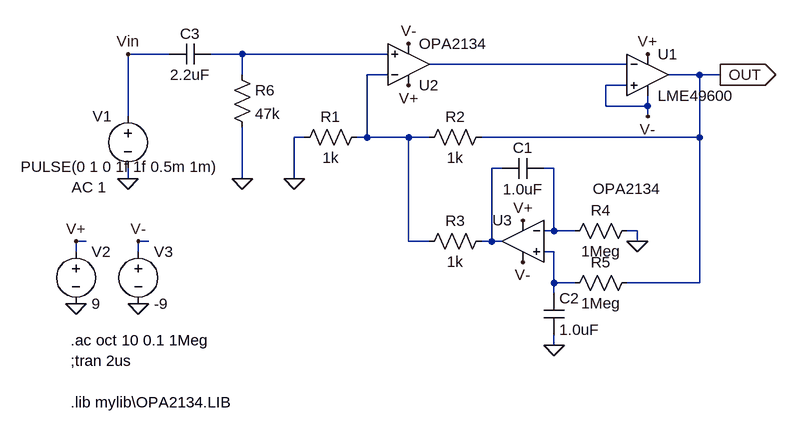
[diagram p0: schematic OPAMP_Servo_AC_Coupling.asc]
OPAMP_Servo_AC_Coupling.asc, the LTspice schematic file:
Version 4
SHEET 1 1064 680
WIRE -256 128 -320 128
WIRE -144 128 -192 128
WIRE 80 128 -144 128
WIRE 448 144 144 144
WIRE -144 160 -144 128
WIRE 80 160 48 160
WIRE 560 160 512 160
WIRE 592 160 560 160
WIRE 448 176 416 176
WIRE 416 208 416 176
WIRE 480 208 480 192
WIRE 480 208 416 208
WIRE -320 224 -320 128
WIRE 480 224 480 208
WIRE -48 256 -64 256
WIRE 48 256 48 160
WIRE 48 256 32 256
WIRE 112 256 48 256
WIRE 144 256 112 256
WIRE 560 256 560 160
WIRE 560 256 224 256
WIRE 256 304 240 304
WIRE 336 304 320 304
WIRE -320 320 -320 304
WIRE -144 320 -144 240
WIRE -64 320 -64 256
WIRE 336 400 336 304
WIRE 336 400 320 400
WIRE 368 400 336 400
WIRE 464 400 448 400
WIRE -384 416 -400 416
WIRE -288 416 -304 416
WIRE 112 416 112 256
WIRE 144 416 112 416
WIRE 240 416 240 304
WIRE 240 416 224 416
WIRE 256 416 240 416
WIRE 464 416 464 400
WIRE -400 432 -400 416
WIRE -304 432 -304 416
WIRE 336 432 320 432
WIRE 336 480 336 432
WIRE 368 480 336 480
WIRE 560 480 560 256
WIRE 560 480 448 480
WIRE 336 496 336 480
WIRE 336 576 336 560
FLAG -320 320 0
FLAG -400 512 0
FLAG -304 512 0
FLAG -400 416 V+
FLAG -304 416 V-
FLAG 480 128 V+
FLAG 480 224 V-
FLAG 592 160 OUT
IOPIN 592 160 Out
FLAG -64 320 0
FLAG 336 576 0
FLAG 464 416 0
FLAG 112 176 V+
FLAG 288 384 V+
FLAG 112 112 V-
FLAG 288 448 V-
FLAG -320 128 Vin
FLAG -144 320 0
SYMBOL Opamps\\LME49600 480 96 R0
SYMATTR InstName U1
SYMBOL voltage -320 208 R0
WINDOW 123 -87 125 Left 2
WINDOW 39 0 0 Left 2
WINDOW 0 -54 16 Left 2
WINDOW 3 -165 93 Left 2
SYMATTR Value2 AC 1
SYMATTR InstName V1
SYMATTR Value PULSE(0 1 0 1f 1f 0.5m 1m)
SYMBOL voltage -400 416 R0
WINDOW 123 0 0 Left 2
WINDOW 39 0 0 Left 2
SYMATTR InstName V2
SYMATTR Value 9
SYMBOL voltage -304 416 R0
WINDOW 123 0 0 Left 2
WINDOW 39 0 0 Left 2
SYMATTR InstName V3
SYMATTR Value -9
SYMBOL res 48 240 R90
WINDOW 0 0 56 VBottom 2
WINDOW 3 32 56 VTop 2
SYMATTR InstName R1
SYMATTR Value 1k
SYMBOL res 240 240 R90
WINDOW 0 0 56 VBottom 2
WINDOW 3 32 56 VTop 2
SYMATTR InstName R2
SYMATTR Value 1k
SYMBOL res 240 400 R90
WINDOW 0 0 56 VBottom 2
WINDOW 3 32 56 VTop 2
SYMATTR InstName R3
SYMATTR Value 1k
SYMBOL res 464 384 R90
WINDOW 0 0 56 VBottom 2
WINDOW 3 32 56 VTop 2
SYMATTR InstName R4
SYMATTR Value 1Meg
SYMBOL res 464 464 R90
WINDOW 0 0 56 VBottom 2
WINDOW 3 32 56 VTop 2
SYMATTR InstName R5
SYMATTR Value 1Meg
SYMBOL cap 320 288 R90
WINDOW 0 0 32 VBottom 2
WINDOW 3 32 32 VTop 2
SYMATTR InstName C1
SYMATTR Value 1.0uF
SYMBOL cap 320 496 R0
SYMATTR InstName C2
SYMATTR Value 1.0uF
SYMBOL Opamps\\opamp2 112 208 M180
SYMATTR InstName U2
SYMATTR Value OPA2134
SYMBOL Opamps\\opamp2 288 352 M0
WINDOW 3 -212 -17 Left 2
SYMATTR Value OPA2134
SYMATTR InstName U3
SYMBOL cap -192 112 R90
WINDOW 0 0 32 VBottom 2
WINDOW 3 32 32 VTop 2
SYMATTR InstName C3
SYMATTR Value 2.2uF
SYMBOL res -160 144 R0
SYMATTR InstName R6
SYMATTR Value 47k
TEXT -408 568 Left 2 !.ac oct 10 0.1 1Meg
TEXT -408 600 Left 2 !;tran 2us
TEXT -408 664 Left 2 !.lib mylib\\OPA2134.LIB

The netlist it stands for:
* OPAMP_Servo_AC_Coupling.asc
XU1 V- N002 V+ V- OUT LME49600  ; pins In+ In- V+ V- OUT
V1 Vin 0 PULSE(0 1 0 1f 1f 0.5m 1m) AC 1
V2 V+ 0 9
V3 V- 0 -9
R1 N003 0 1k
R2 OUT N003 1k
R3 N004 N003 1k
R4 0 N005 1Meg
R5 OUT N006 1Meg
C1 N005 N004 1.0uF
C2 N006 0 1.0uF
XU2 N001 N003 V+ V- N002 OPA2134  ; pins In+ In- V+ V- OUT
XU3 N006 N005 V+ V- N004 OPA2134  ; pins In+ In- V+ V- OUT
C3 N001 Vin 2.2uF
R6 N001 0 47k
.ac oct 10 0.1 1Meg
;tran 2us
.lib mylib\OPA2134.LIB
.backanno
.end